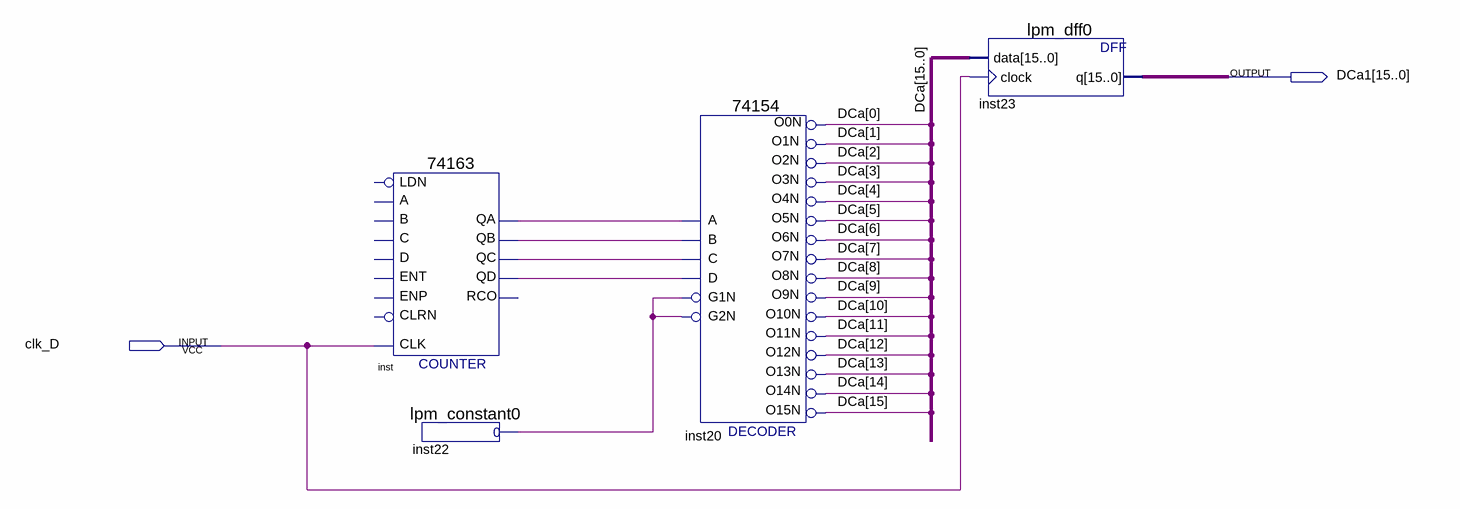
[diagram p0: schematic sheet]
// Quartus schematic Block3.bdf as structural Verilog: 4 symbols, 2 pins
module Block3 (
  input  clk_D,
  output [15:0] DCa1
);

  wire inst22_result, inst_qa, inst_qb, inst_qc, inst_qd;
  wire [15:0] DCa;

  \74163  inst (
    .CLK(clk_D), .QA(inst_qa), .QB(inst_qb), .QC(inst_qc), .QD(inst_qd));  // open: C, B, A, ENT, D, CLRN, ENP, LDN, RCO
  lpm_constant0 inst22 (.result(inst22_result));
  \74154  inst20 (
    .C(inst_qc), .D(inst_qd), .B(inst_qb), .A(inst_qa), .G1N(inst22_result), .G2N(inst22_result),
    .O0N(DCa[0]), .O12N(DCa[12]), .O15N(DCa[15]), .O10N(DCa[10]), .O11N(DCa[11]), .O1N(DCa[1]),
    .O13N(DCa[13]), .O14N(DCa[14]), .O4N(DCa[4]), .O3N(DCa[3]), .O2N(DCa[2]), .O7N(DCa[7]), .O6N(DCa[6]),
    .O5N(DCa[5]), .O9N(DCa[9]), .O8N(DCa[8]));
  lpm_dff0 inst23 (.data(DCa), .clock(clk_D), .q(DCa1));
endmodule
